# EAGLE schematic PCB Capacitor (EAGLE 9.6.2)
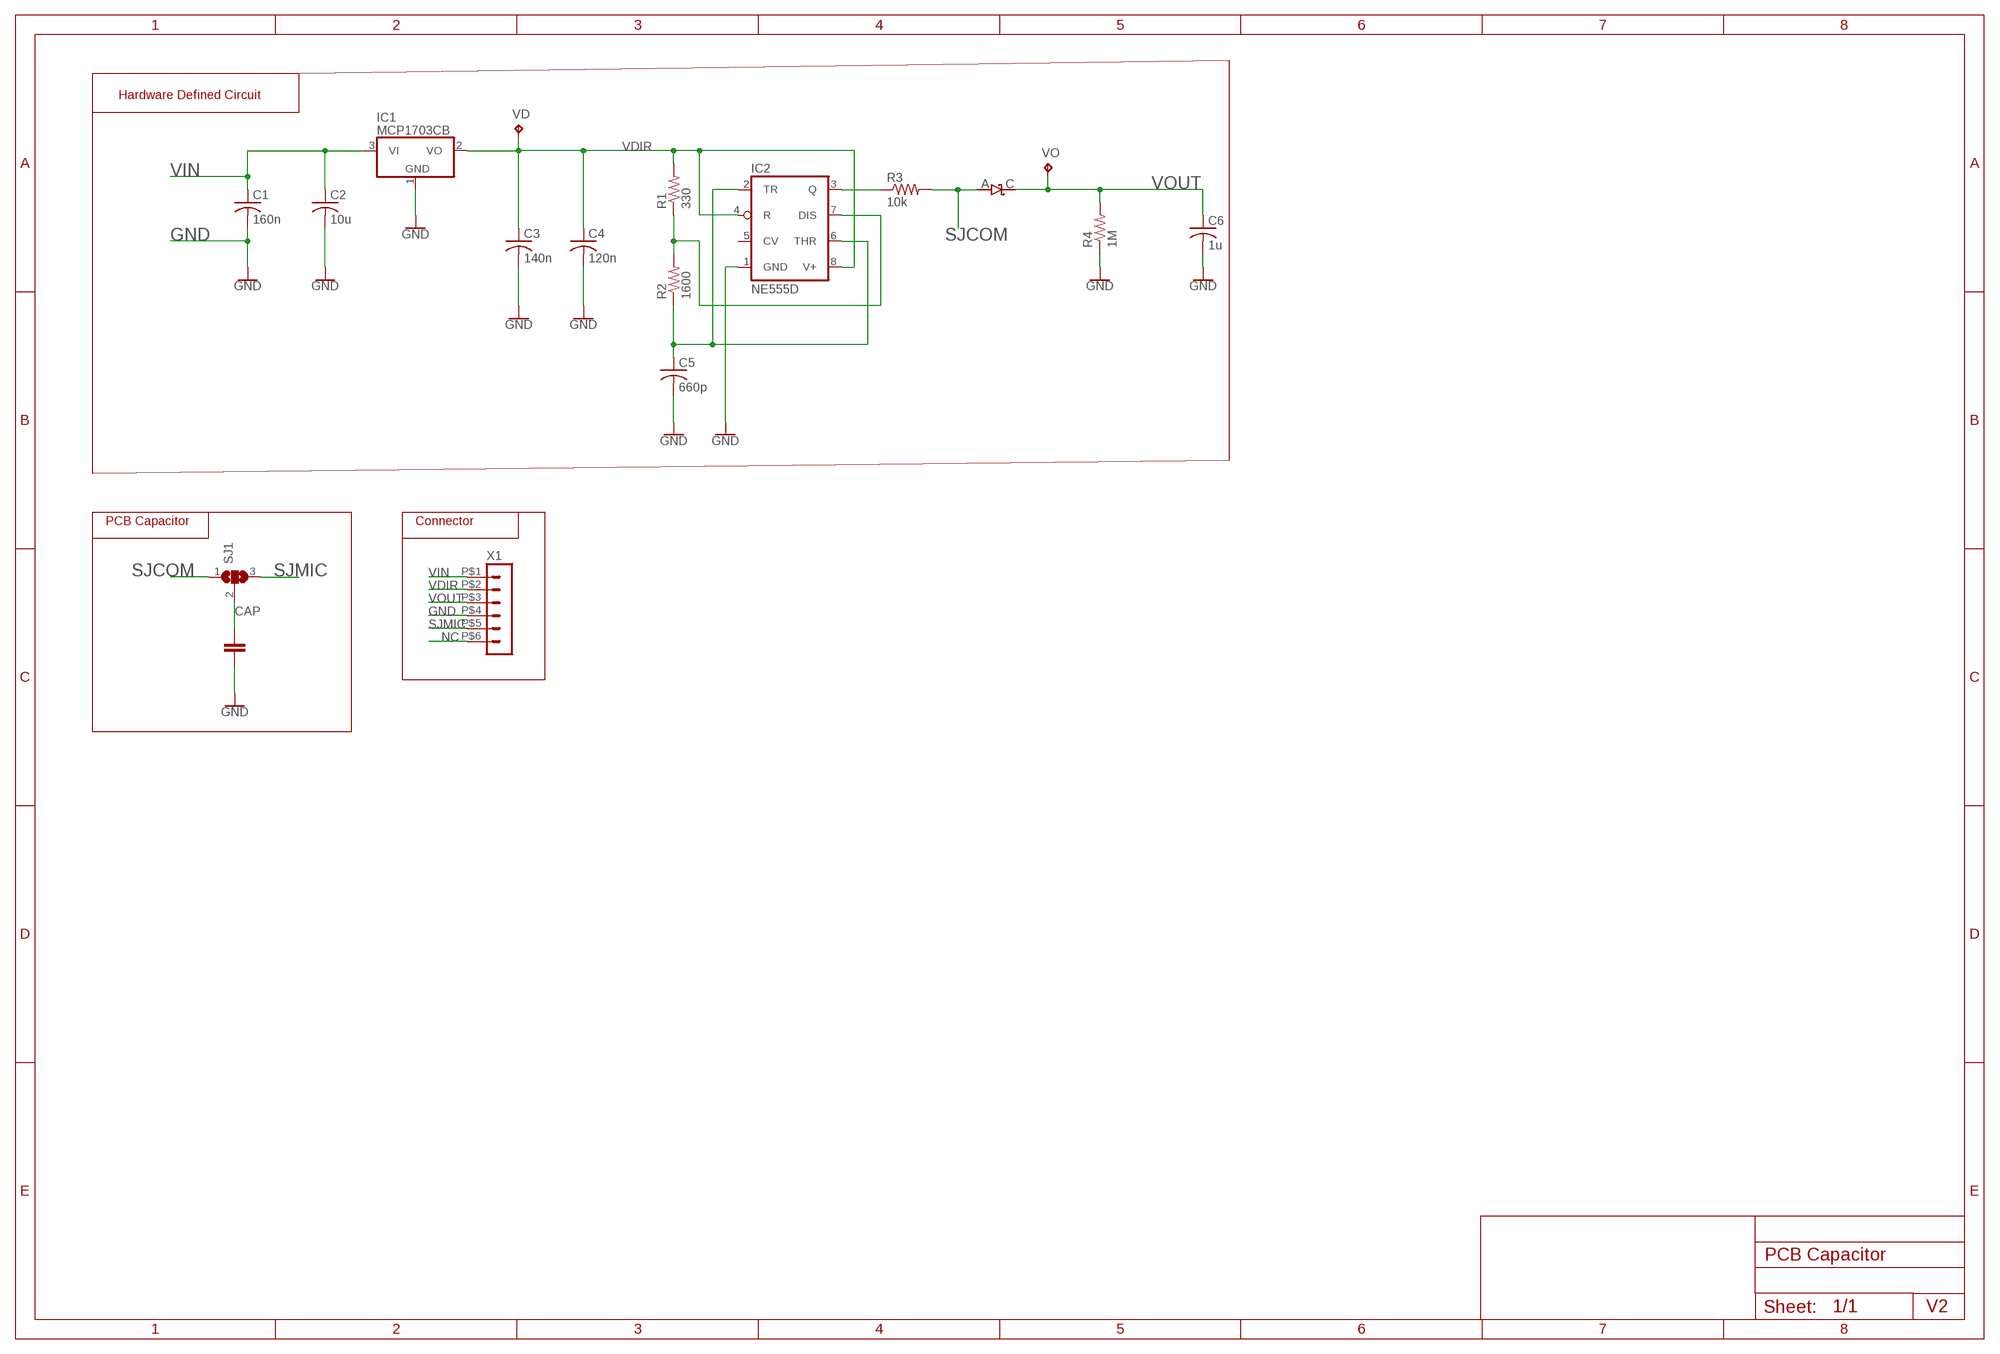
[diagram p0: schematic, sheet 1]

## Parts
C1  160n  C-USC0805  [C0805]
C2  10u  C-USC0805  [C0805]
C3  140n  C-USC0805  [C0805]
C4  120n  C-USC0805  [C0805]
C5  660p  C-USC0805  [C0805]
C6  1u  C-USC0805  [C0805]
D11  DIODE_SCHOTTKY_CMMSH2-40  [SOD-123]
IC1  MCP1703CB  [SOT23]
IC2  NE555D  [SO08]
R1  330  R-US_R0603  [R0603]
R2  1600  R-US_R0603  [R0603]
R3  10k  R-US_R0603  [R0603]
R4  1M  R-US_R0603  [R0603]
SJ1  SJ2W  [SJ_2]
VD  TPB1,27  [B1,27]
VO  TPB1,27  [B1,27]
X1  HEADER_POS6_43045-0600  [43045-0600]

## Nets
CAP: SJ1.2
GND: C1.2 C2.2 C3.2 C4.2 C5.2 C6.2 IC1.1(GND) IC2.1(GND) R4.1 X1.P$4
N$2: IC2.7(DIS) R1.1 R2.2
N$3: C5.1 IC2.2(TR) IC2.6(THR) R2.1
N$9: IC2.3(Q) R3.1
NC: X1.P$6
SJCOM: D11.A R3.2 SJ1.1
SJMIC: SJ1.3 X1.P$5
VDIR: C3.1 C4.1 IC1.2(VO) IC2.4(R) IC2.8(V+) R1.2 VD.TP X1.P$2
VIN: C1.1 C2.1 IC1.3(VI) X1.P$1
VOUT: C6.1 D11.C R4.2 VO.TP X1.P$3
Unconnected: IC2.5(CV)

## Notes on the sheet
- Hardware Defined Circuit
- PCB Capacitor | Connector
- V2

## Library data of the parts
C1-C6 = rcl:C-US: CAPACITOR, American symbol; SPICEPREFIX: C
D11 = diode:DIODE_SCHOTTKY_CMMSH2-40
IC1 = linear:MCP1703: 250 mA, 16V, Low Quiescent Current LDO Regulator Source: http://ww1.microchip.com/downloads/en/DeviceDoc/22049b.pdf
IC2 = linear:*555: TIMER
R1-R4 = rcl:R-US_: RESISTOR, American symbol; SPICEPREFIX: R
SJ1 = jumper:SJ2W: SMD solder JUMPER
VD VO = testpad:TP: Test pad
X1 = con-molex-micro-fit-3_0:HEADER_POS6_?: Molex - Micro-Fit 3.0 Series connector, 3.00mm (0.118") pitch header, 6 positions.